# EAGLE schematic Optronik (EAGLE 7.5.0)

## Sheet 1 of 4: MCU_MAIN
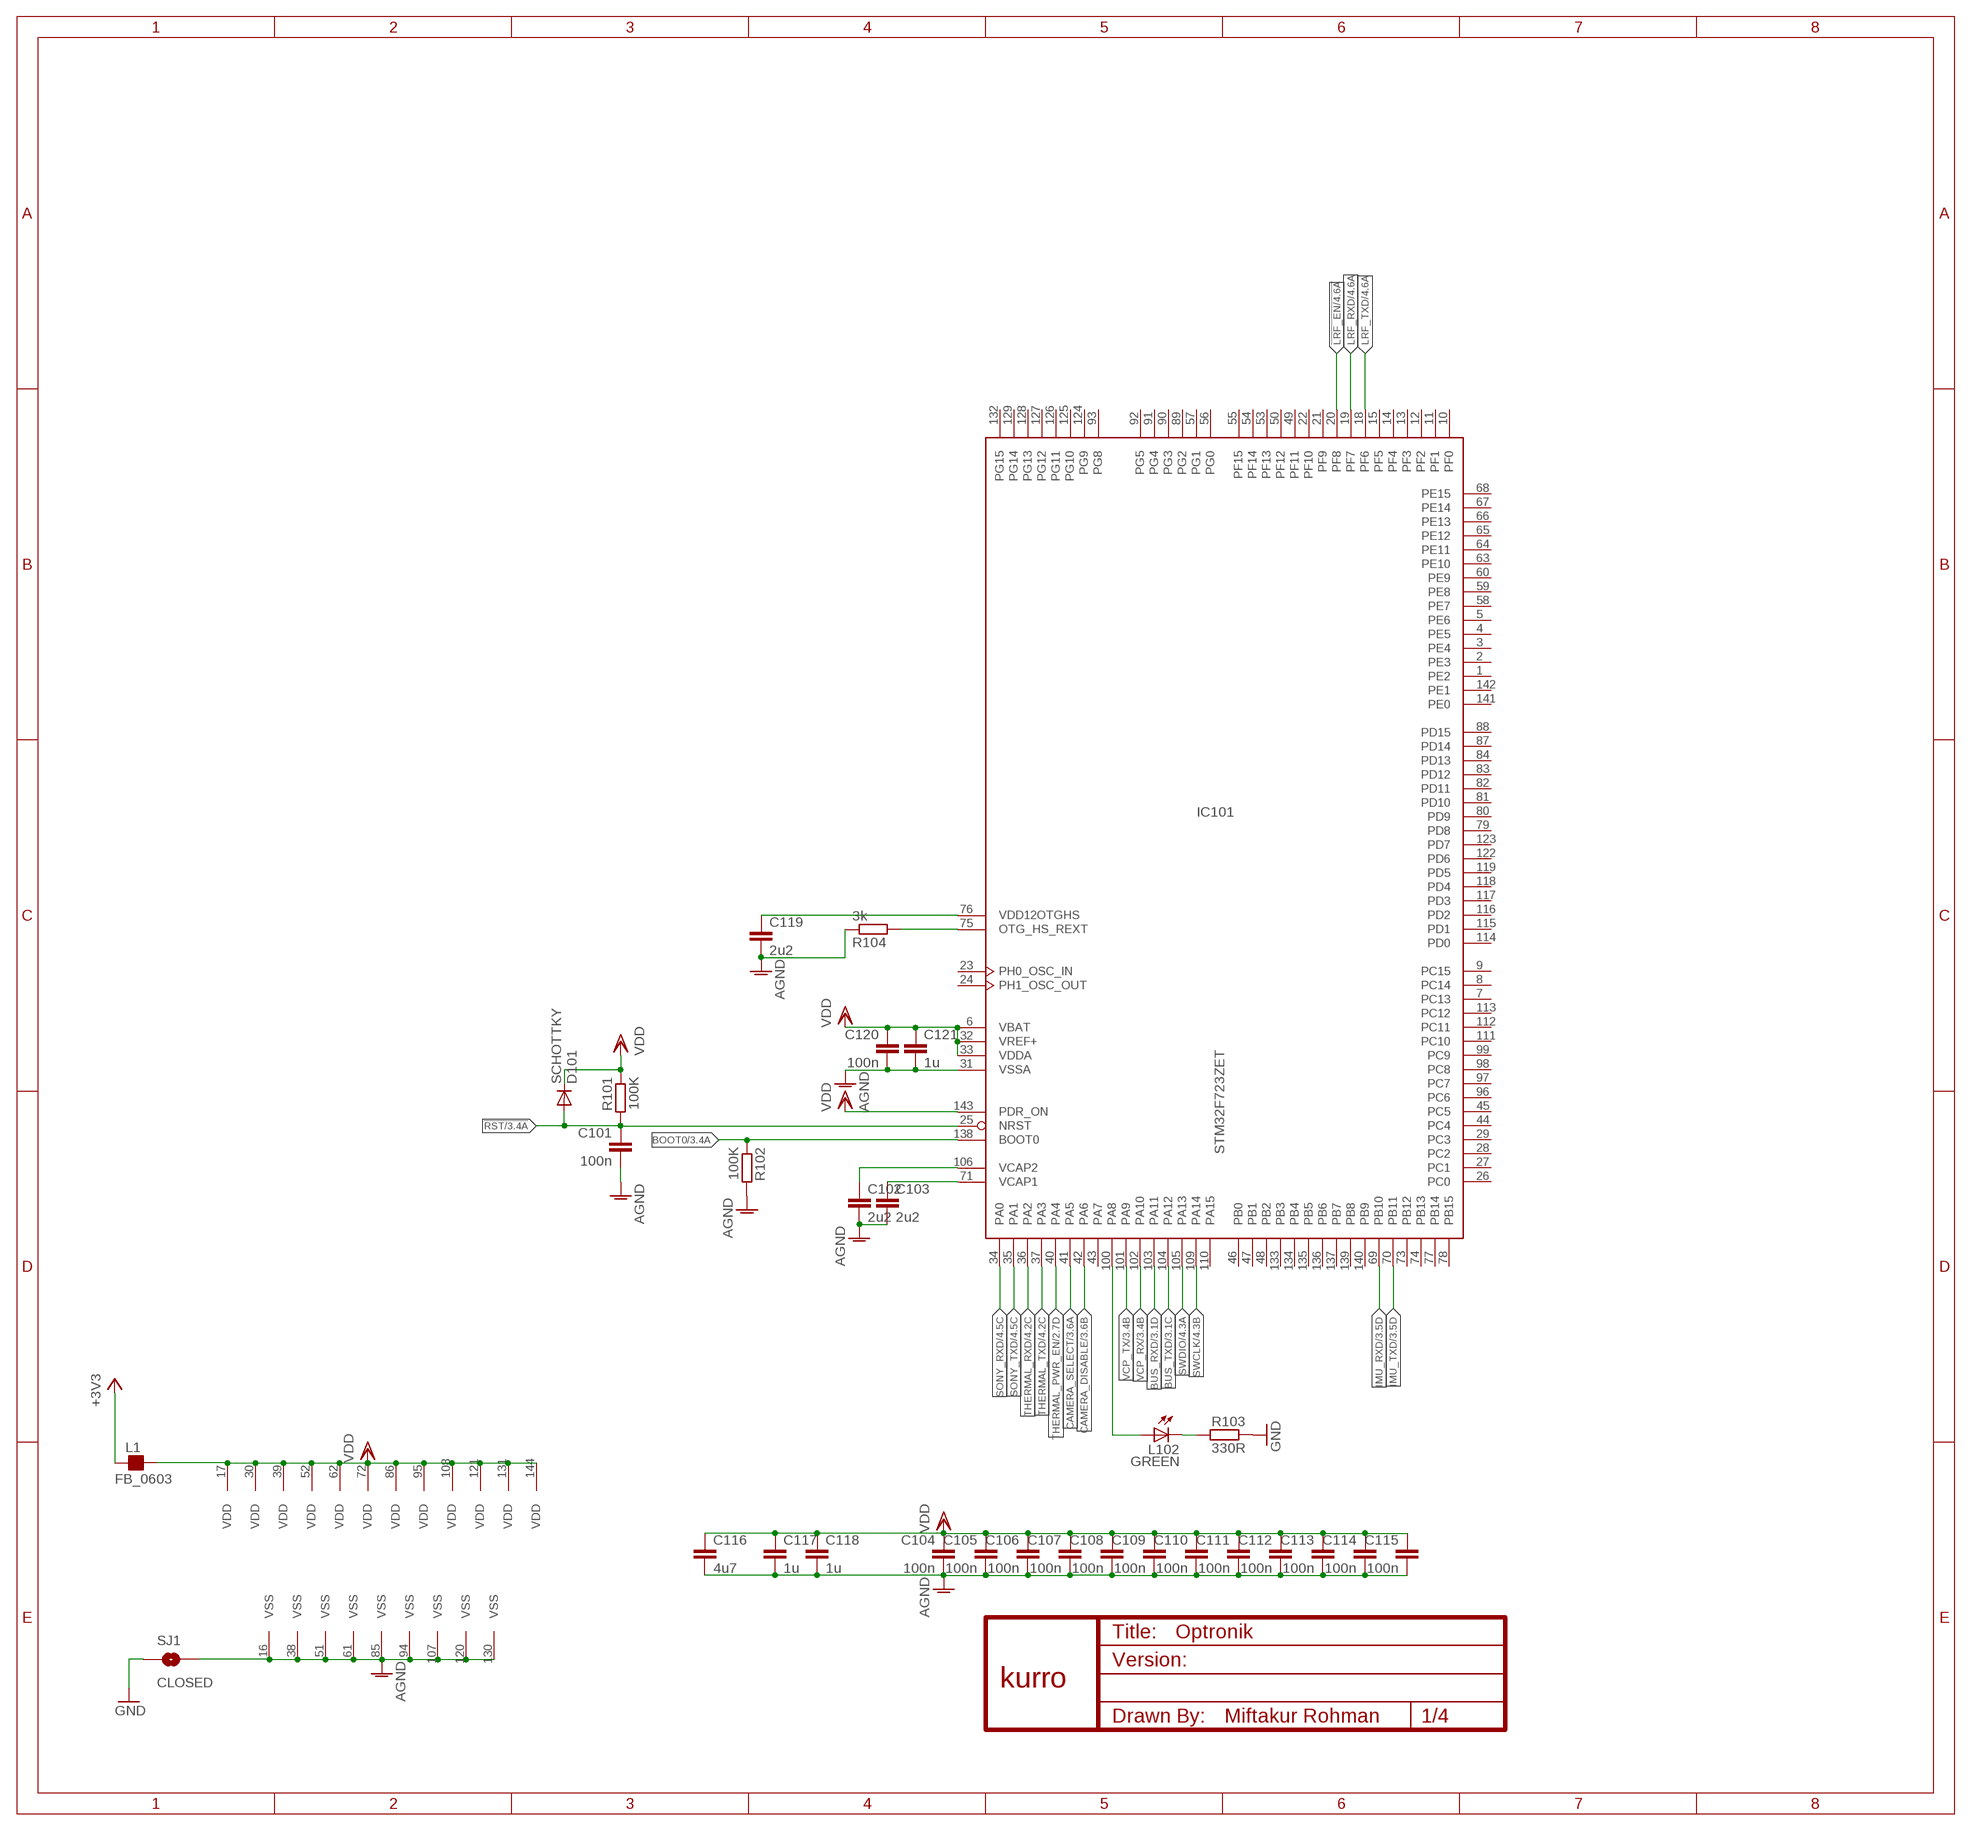
[diagram p0: schematic, sheet 1]

### Parts
C101  100n  C-EUC0603  [C0603]
C102  2u2  C-EUC0805  [C0805]
C103  2u2  C-EUC0805  [C0805]
C104  100n  C-EUC0603  [C0603]
C105  100n  C-EUC0603  [C0603]
C106  100n  C-EUC0603  [C0603]
C107  100n  C-EUC0603  [C0603]
C108  100n  C-EUC0603  [C0603]
C109  100n  C-EUC0603  [C0603]
C110  100n  C-EUC0603  [C0603]
C111  100n  C-EUC0603  [C0603]
C112  100n  C-EUC0603  [C0603]
C113  100n  C-EUC0603  [C0603]
C114  100n  C-EUC0603  [C0603]
C115  100n  C-EUC0603  [C0603]
C116  4u7  C-EUC0805  [C0805]
C117  1u  C-EUC0805  [C0805]
C118  1u  C-EUC0805  [C0805]
C119  2u2  C-EUC0805  [C0805]
C120  100n  C-EUC0603  [C0603]
C121  1u  C-EUC0805  [C0805]
D101  SCHOTTKY  DIODE-MICROMELF-W  [MICROMELF-W]
IC101  STM32F723ZET  [LQFP144-2]
L1  FB_0603  [L0603]
L102  GREEN  LEDCHIP-LED0805  [CHIP-LED0805]
R101  100K  R-EU_R0603  [R0603]
R102  100K  R-EU_R0603  [R0603]
R103  330R  R-EU_R0603  [R0603]
R104  3k  R-EU_R0603  [R0603]
SJ1  CLOSED  SOLDERJUMPERTRACE_THICK  [SJ_2S-TRACE_THICK]
U$2  KURRO_FOOTPRINT  [KURRO-LOGO]

### Nets
!LRF_EN [ic]: IC101.20(PF8) ; also sheet 4
!RST [ic]: C101.1 D101.A IC101.25(NRST) R101.2 ; also sheet 3
+3V3: L1.1 ; also sheet 2,3
AGND [ic]: C101.2 C102.2 C103.2 C104.2 C105.2 C106.2 C107.2 C108.2 C109.2 C110.2 C111.2 C112.2 C113.2 C114.2 C115.2 C116.2 C117.2 C118.2 C119.2 C120.2 C121.2 IC101.16(VSS) IC101.31(VSSA) IC101.38(VSS) IC101.51(VSS) IC101.61(VSS) IC101.85(VSS) IC101.94(VSS) IC101.107(VSS) IC101.120(VSS) IC101.130(VSS) R102.2 R104.1 SJ1.2
BOOT0 [ic]: IC101.138(BOOT0) R102.1 ; also sheet 3
BUS_RXD: IC101.103(PA11) ; also sheet 3
BUS_TXD: IC101.104(PA12) ; also sheet 3
CAMERA_DISABLE: IC101.42(PA6) ; also sheet 3
CAMERA_SELECT [ic]: IC101.41(PA5) ; also sheet 3
GND: R103.1 SJ1.1 ; also sheet 2,3,4
IMU_RXD [ic]: IC101.69(PB10) ; also sheet 3
IMU_TXD [ic]: IC101.70(PB11) ; also sheet 3
LRF_RXD [ic]: IC101.19(PF7) ; also sheet 4
LRF_TXD [ic]: IC101.18(PF6) ; also sheet 4
N$1: IC101.75(OTG_HS_REXT) R104.2
N$2: IC101.100(PA8) L102.A
N$9: L102.C R103.2
N$13: C119.1 IC101.76(VDD12OTGHS)
N$30: C103.1 IC101.71(VCAP1)
N$46: C102.1 IC101.106(VCAP2)
SONY_RXD [ic]: IC101.34(PA0) ; also sheet 4
SONY_TXD [ic]: IC101.35(PA1) ; also sheet 4
SWCLK [ic]: IC101.109(PA14) ; also sheet 4
SWDIO [ic]: IC101.105(PA13) ; also sheet 4
THERMAL_PWR_EN [ic]: IC101.40(PA4) ; also sheet 2
THERMAL_RXD [ic]: IC101.36(PA2) ; also sheet 4
THERMAL_TXD [ic]: IC101.37(PA3) ; also sheet 4
VCP_RX [ic]: IC101.102(PA10) ; also sheet 3,4
VCP_TX [ic]: IC101.101(PA9) ; also sheet 3,4
VDD [ic]: C104.1 C105.1 C106.1 C107.1 C108.1 C109.1 C110.1 C111.1 C112.1 C113.1 C114.1 C115.1 C116.1 C117.1 C118.1 C120.1 C121.1 D101.C IC101.6(VBAT) IC101.17(VDD) IC101.30(VDD) IC101.32(VREF+) IC101.33(VDDA) IC101.39(VDD) IC101.52(VDD) IC101.62(VDD) IC101.72(VDD) IC101.86(VDD) IC101.95(VDD) IC101.108(VDD) IC101.121(VDD) IC101.131(VDD) IC101.143(PDR_ON) IC101.144(VDD) L1.2 R101.1 ; also sheet 4
Unconnected: IC101.1(PE2) IC101.2(PE3) IC101.3(PE4) IC101.4(PE5) IC101.5(PE6) IC101.7(PC13) IC101.8(PC14) IC101.9(PC15) IC101.10(PF0) IC101.11(PF1) IC101.12(PF2) IC101.13(PF3) IC101.14(PF4) IC101.15(PF5) IC101.21(PF9) IC101.22(PF10) IC101.23(PH0_OSC_IN) IC101.24(PH1_OSC_OUT) IC101.26(PC0) IC101.27(PC1) IC101.28(PC2) IC101.29(PC3) IC101.43(PA7) IC101.44(PC4) IC101.45(PC5) IC101.46(PB0) IC101.47(PB1) IC101.48(PB2) IC101.49(PF11) IC101.50(PF12) IC101.53(PF13) IC101.54(PF14) IC101.55(PF15) IC101.56(PG0) IC101.57(PG1) IC101.58(PE7) IC101.59(PE8) IC101.60(PE9) IC101.63(PE10) IC101.64(PE11) IC101.65(PE12) IC101.66(PE13) IC101.67(PE14) IC101.68(PE15) IC101.73(PB12) IC101.74(PB13) IC101.77(PB14) IC101.78(PB15) IC101.79(PD8) IC101.80(PD9) IC101.81(PD10) IC101.82(PD11) IC101.83(PD12) IC101.84(PD13) IC101.87(PD14) IC101.88(PD15) IC101.89(PG2) IC101.90(PG3) IC101.91(PG4) IC101.92(PG5) IC101.93(PG8) IC101.96(PC6) IC101.97(PC7) IC101.98(PC8) IC101.99(PC9) IC101.110(PA15) IC101.111(PC10) IC101.112(PC11) IC101.113(PC12) IC101.114(PD0) IC101.115(PD1) IC101.116(PD2) IC101.117(PD3) IC101.118(PD4) IC101.119(PD5) IC101.122(PD6) IC101.123(PD7) IC101.124(PG9) IC101.125(PG10) IC101.126(PG11) IC101.127(PG12) IC101.128(PG13) IC101.129(PG14) IC101.132(PG15) IC101.133(PB3) IC101.134(PB4) IC101.135(PB5) IC101.136(PB6) IC101.137(PB7) IC101.139(PB8) IC101.140(PB9) IC101.141(PE0) IC101.142(PE1)

## Sheet 2 of 4: PSU
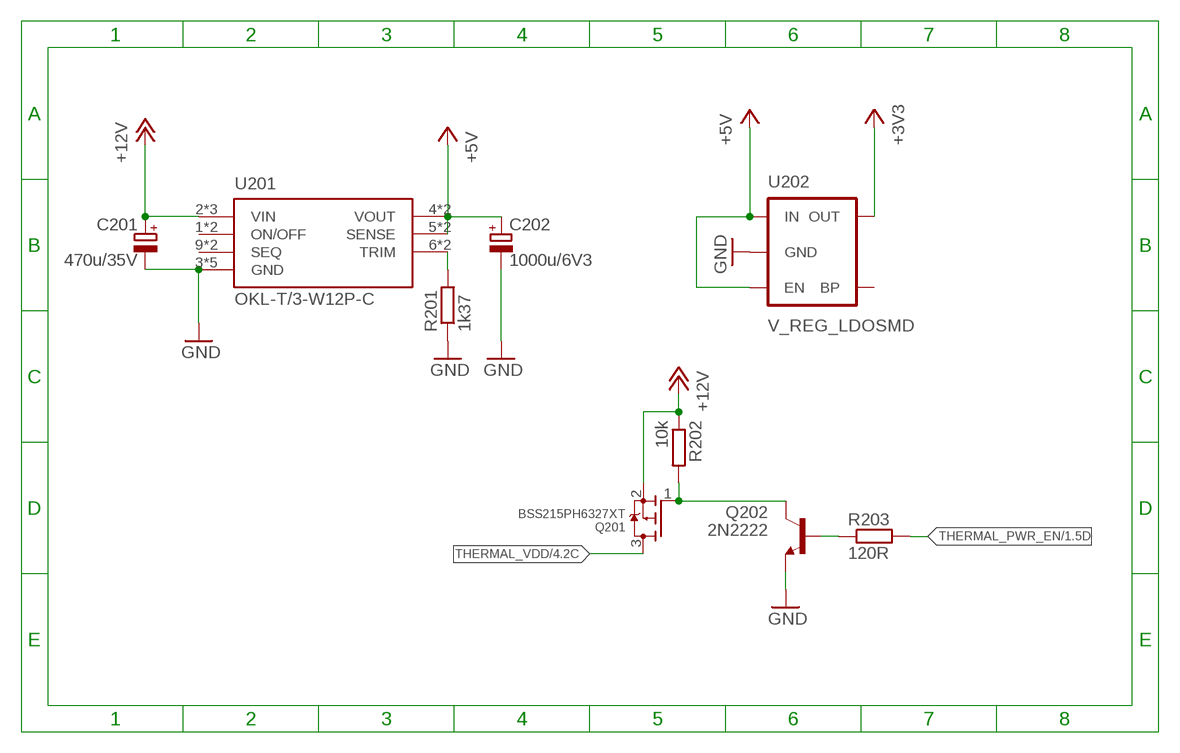
[diagram p1: schematic, sheet 2]

### Parts
C201  470u/35V  CPOL-EU153CLV-1012  [153CLV-1012]
C202  1000u/6V3  CPOL-EU153CLV-0810  [153CLV-0810]
Q201  BSS215PH6327XT  A03401-WIDE  [SOT23-W]
Q202  2N2222  2N2222-REFLOW  [SOT23]
R201  1k37  R-EU_R0603  [R0603]
R202  10k  R-EU_R0603  [R0603]
R203  120R  R-EU_R0603  [R0603]
U201  OKL-T/3-W12P-C  OKL2T/3W5NC_SMD  [OKL2T/3W5NC]
U202  V_REG_LDOSMD  [SOT23-5]

### Nets
+3V3: U202.5(OUT) ; also sheet 1,3
+5V: C202.+ U201.4(VOUT) U201.4@1(VOUT) U201.5(SENSE) U201.5@1(SENSE) U202.1(IN) U202.3(EN) ; also sheet 3,4
+12V: C201.+ Q201.2(S) R202.1 U201.2(VIN) U201.2@1(VIN) U201.2@2(VIN) ; also sheet 4
GND: C201.- C202.- Q202.2(E) R201.1 U201.3(GND) U201.3@1(GND) U201.3@2(GND) U201.7(GND) U201.7@1(GND) U202.2(GND) ; also sheet 1,3,4
N$6: R201.2 U201.6(TRIM) U201.6@1(TRIM)
N$17: Q202.1(B) R203.1
N$39: Q201.1(G) Q202.3(C) R202.2
THERMAL_PWR_EN [ic]: R203.2 ; also sheet 1
THERMAL_VDD: Q201.3(D) ; also sheet 4
Unconnected: U201.1(ON/OFF) U201.1@1(ON/OFF) U201.9(SEQ) U201.9@1(SEQ) U202.4(BP)

## Sheet 3 of 4
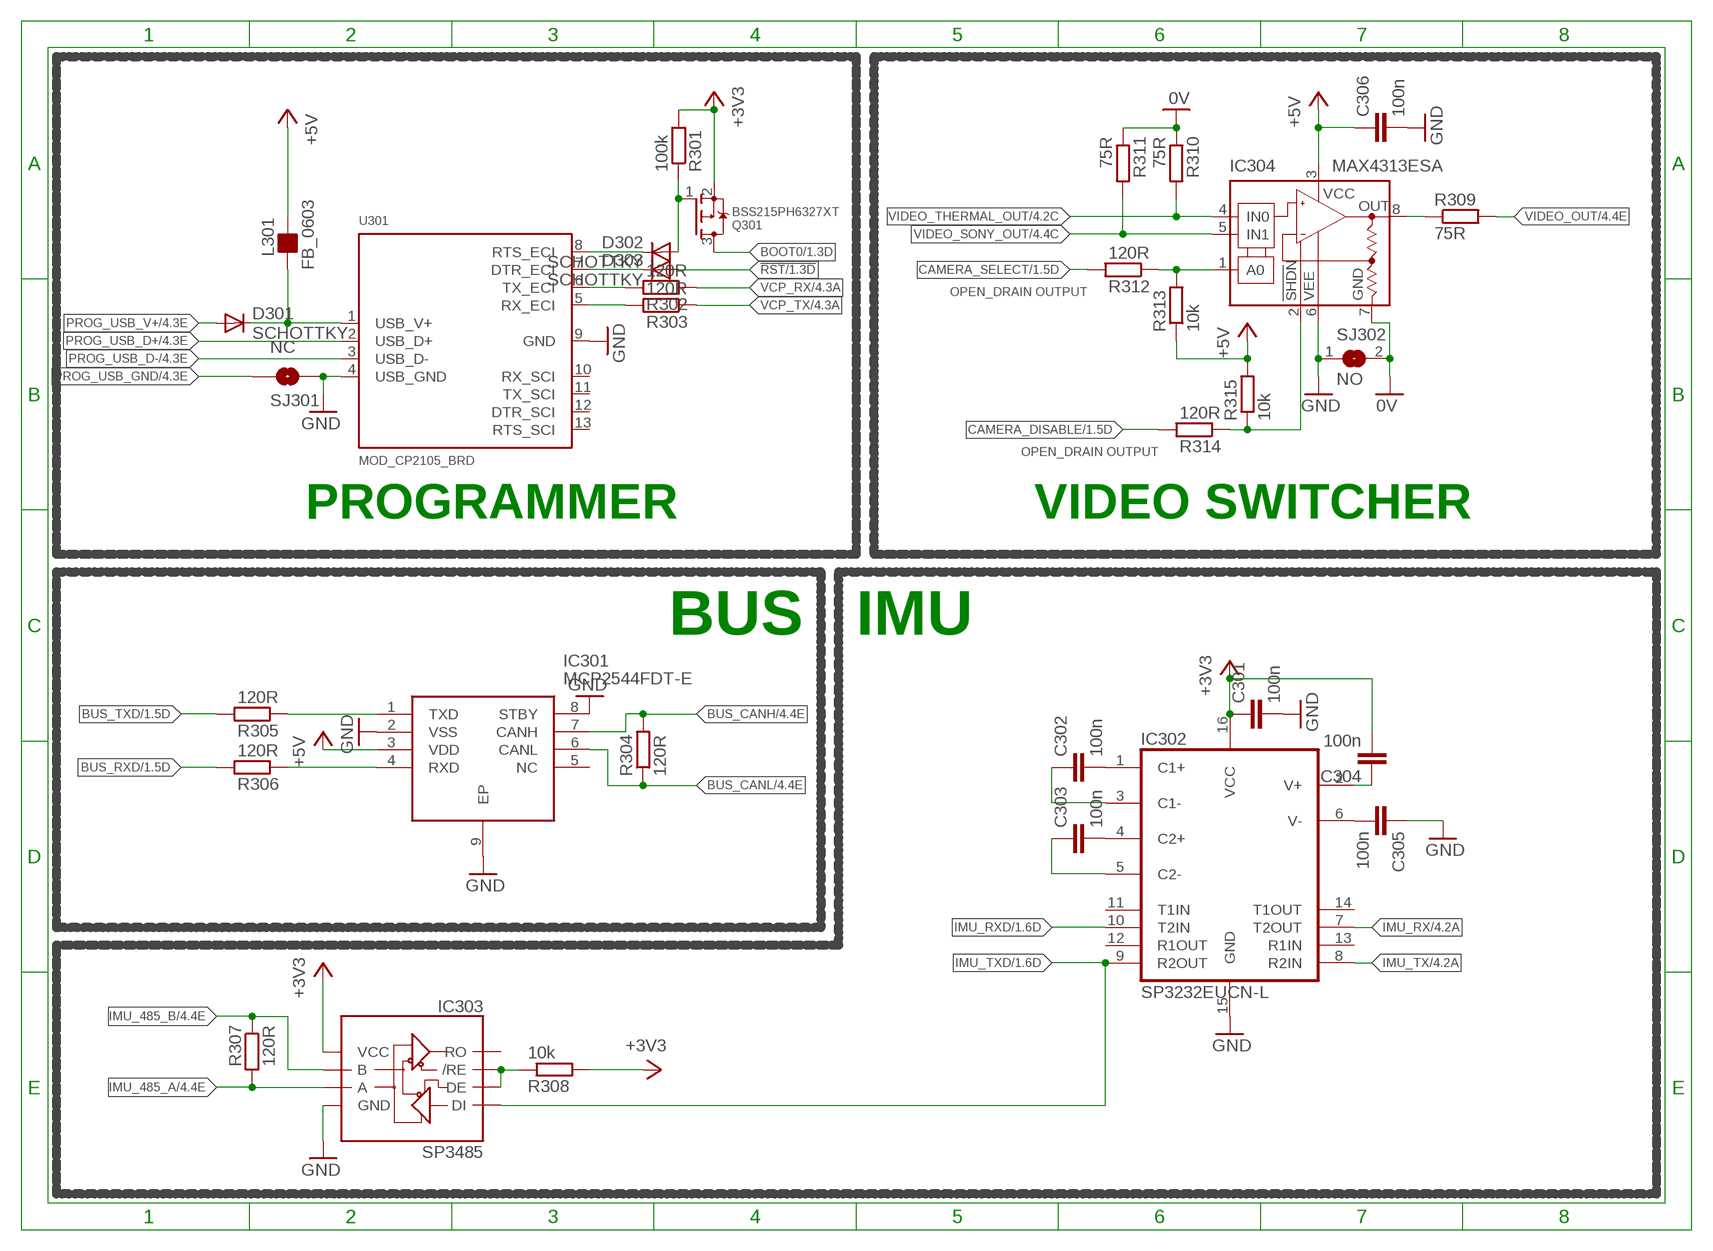
[diagram p2: schematic, sheet 3]

### Parts
C301  100n  C-EUC0603  [C0603]
C302  100n  C-EUC0603  [C0603]
C303  100n  C-EUC0603  [C0603]
C304  100n  C-EUC0603  [C0603]
C305  100n  C-EUC0603  [C0603]
C306  100n  C-EUC0603  [C0603]
D301  SCHOTTKY  DIODE-MICROMELF-W  [MICROMELF-W]
D302  SCHOTTKY  DIODE-MICROMELF-W  [MICROMELF-W]
D303  SCHOTTKY  DIODE-MICROMELF-W  [MICROMELF-W]
IC301  MCP2544FDT-E  [TDFN-8]
IC302  SP3232EUCN-L  MAX232SOIC16  [SO016]
IC303  SP3485  RS485SOIC  [SO08]
IC304  MAX4313ESA  [SO08]
L301  FB_0603  [L0603]
Q301  BSS215PH6327XT  A03401-WIDE  [SOT23-W]
R301  100k  R-EU_R0603  [R0603]
R302  120R  R-EU_R0603  [R0603]
R303  120R  R-EU_R0603  [R0603]
R304  120R  R-EU_R0603  [R0603]
R305  120R  R-EU_R0603  [R0603]
R306  120R  R-EU_R0603  [R0603]
R307  120R  R-EU_R0603  [R0603]
R308  10k  R-EU_R0603  [R0603]
R309  75R  R-EU_R0603  [R0603]
R310  75R  R-EU_R0603  [R0603]
R311  75R  R-EU_R0603  [R0603]
R312  120R  R-EU_R0603  [R0603]
R313  10k  R-EU_R0603  [R0603]
R314  120R  R-EU_R0603  [R0603]
R315  10k  R-EU_R0603  [R0603]
SJ301  NC  SOLDERJUMPERTRACE_THICK  [SJ_2S-TRACE_THICK]
SJ302  NO  SJS  [SJS]
U301  MOD_CP2105_BRD  [MOD_CP2105_BOARD]

### Nets
0V: IC304.7(GND) R310.1 R311.1 SJ302.2 ; also sheet 4
!RST [ic]: D303.A ; also sheet 1
+3V3: C301.1 C304.2 IC302.16(VCC) IC303.8(VCC) Q301.2(S) R301.2 R308.2 ; also sheet 1,2
+5V: C306.1 IC301.3(VDD) IC304.3(V+) L301.2 R313.1 R315.2 ; also sheet 2,4
BOOT0 [ic]: Q301.3(D) ; also sheet 1
BUS_CANH: IC301.7(CANH) R304.2 ; also sheet 4
BUS_CANL: IC301.6(CANL) R304.1 ; also sheet 4
BUS_RXD: R306.2 ; also sheet 1
BUS_TXD: R305.2 ; also sheet 1
CAMERA_DISABLE: R314.2 ; also sheet 1
CAMERA_SELECT [ic]: R312.2 ; also sheet 1
GND: C301.2 C305.1 C306.2 IC301.2(VSS) IC301.8(STBY) IC301.9(EP) IC302.15(GND) IC303.5(GND) IC304.6(V-) SJ301.2 SJ302.1 U301.4(USB_GND) U301.9(GND) ; also sheet 1,2,4
IMU_485_A: IC303.6(A) R307.2 ; also sheet 4
IMU_485_B: IC303.7(B) R307.1 ; also sheet 4
IMU_RX: IC302.7(T2OUT) ; also sheet 4
IMU_RXD [ic]: IC302.10(T2IN) ; also sheet 1
IMU_TX: IC302.8(R2IN) ; also sheet 4
IMU_TXD [ic]: IC302.9(R2OUT) IC303.4(DI) ; also sheet 1
N$10: IC303.2(/RE) IC303.3(DE) R308.1
N$12: IC304.1(A0) R312.1 R313.2
N$14: IC301.1(TXD) R305.1
N$15: IC301.4(RXD) R306.1
N$16: R303.2 U301.5(RX_ECI)
N$18: R302.2 U301.6(TX_ECI)
N$19: D303.C U301.7(DTR_ECI)
N$20: IC304.8(OUT) R309.1
N$21: D302.C U301.8(RTS_ECI)
N$22: IC304.2(!SHDN) R314.1 R315.1
N$23: D301.C L301.1 U301.1(USB_V+)
N$24: D302.A Q301.1(G) R301.1
N$31: C305.2 IC302.6(V-)
N$32: C302.2 IC302.1(C1+)
N$33: C303.2 IC302.4(C2+)
N$68: C302.1 IC302.3(C1-)
N$69: C303.1 IC302.5(C2-)
N$72: C304.1 IC302.2(V+)
PROG_USB_D+: U301.2(USB_D+) ; also sheet 4
PROG_USB_D-: U301.3(USB_D-) ; also sheet 4
PROG_USB_GND: SJ301.1 ; also sheet 4
PROG_USB_V+: D301.A ; also sheet 4
VCP_RX [ic]: R302.1 ; also sheet 1,4
VCP_TX [ic]: R303.1 ; also sheet 1,4
VIDEO_OUT: R309.2 ; also sheet 4
VIDEO_SONY_OUT [ic]: IC304.5(IN1) R311.2 ; also sheet 4
VIDEO_THERMAL_OUT: IC304.4(IN0) R310.2 ; also sheet 4
Unconnected: IC301.5(NC) IC302.11(T1IN) IC302.12(R1OUT) IC302.13(R1IN) IC302.14(T1OUT) IC303.1(RO) U301.10(RX_SCI) U301.11(TX_SCI) U301.12(DTR_SCI) U301.13(RTS_SCI)

### Notes on the sheet
- OPEN_DRAIN OUTPUT
- OPEN_DRAIN OUTPUT
- PROGRAMMER | VIDEO SWITCHER
- BUS | IMU

## Sheet 4 of 4: CONNECTOR
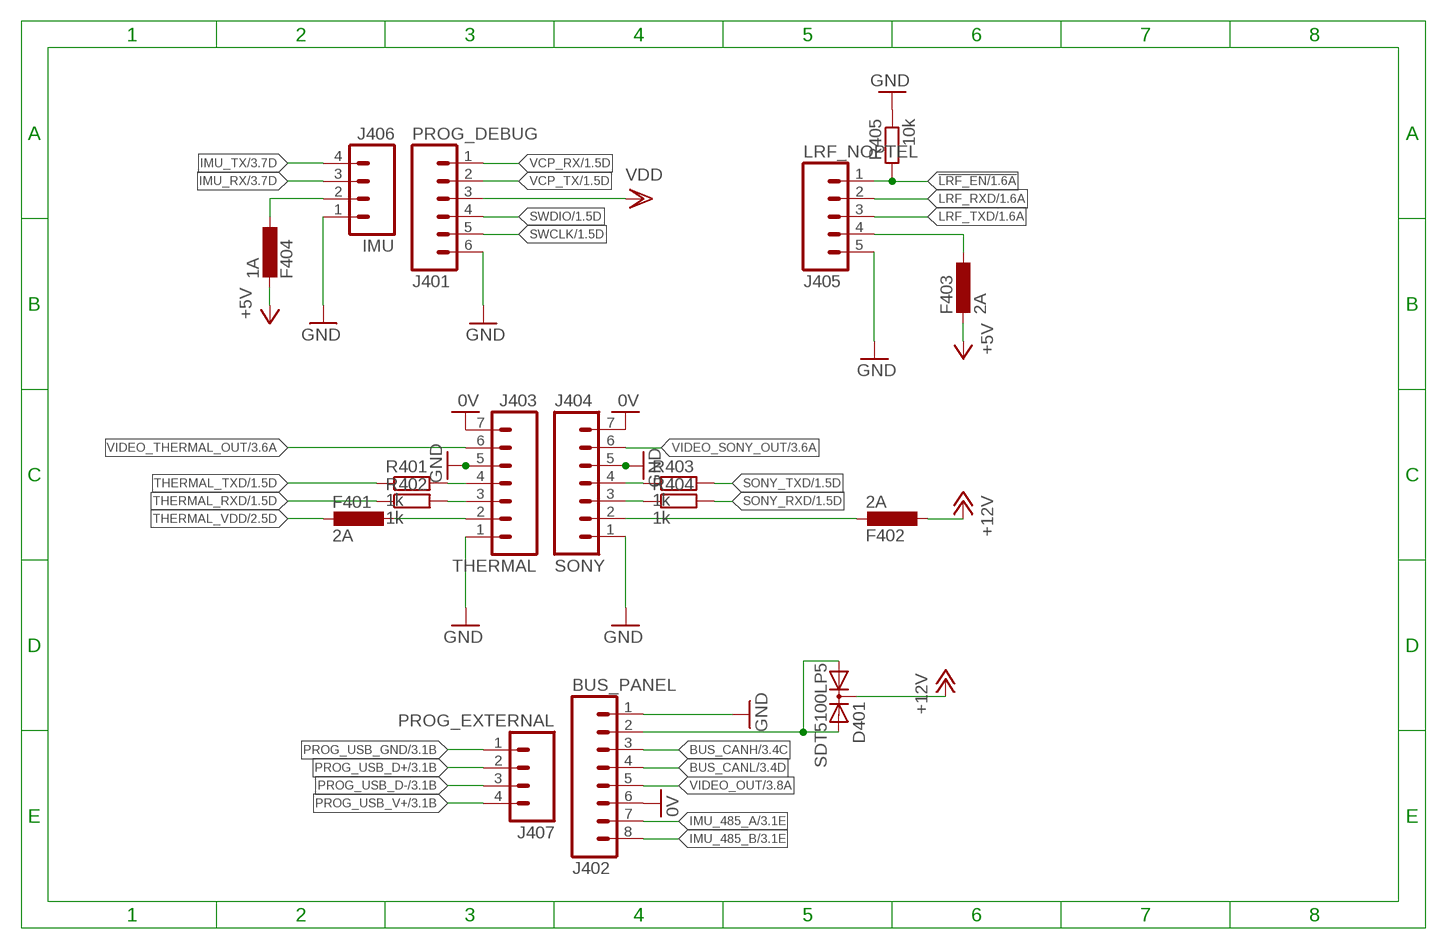
[diagram p3: schematic, sheet 4]

### Parts
D401  SDT5100LP5  [POWERDI5-3]
F401  2A  L-EUL0805  [L0805]
F402  2A  L-EUL0805  [L0805]
F403  2A  L-EUL0805  [L0805]
F404  1A  L-EUL0805  [L0805]
J401  PROG_DEBUG  M06-XHS-VERT-SMD  [XHS-6-VERT-SMD]
J402  BUS_PANEL  M08-XHS-RA  [XHS-8-RA]
J403  THERMAL  M07-XHS-RA  [XHS-7-RA]
J404  SONY  M07-XHS-RA  [XHS-7-RA]
J405  LRF_NOPTEL  M05-XHS-RA  [XHS-5-RA]
J406  IMU  M04-XHS-RA  [XHS-4-RA]
J407  PROG_EXTERNAL  M04-XHS-RA  [XHS-4-RA]
R401  1k  R-EU_R0603  [R0603]
R402  1k  R-EU_R0603  [R0603]
R403  1k  R-EU_R0603  [R0603]
R404  1k  R-EU_R0603  [R0603]
R405  10k  R-EU_R0603  [R0603]

### Nets
0V: J402.6 J403.7 J404.7 ; also sheet 3
!LRF_EN [ic]: J405.1 R405.2 ; also sheet 1
+5V: F403.2 F404.2 ; also sheet 2,3
+12V: D401.3 F402.1 ; also sheet 2
BUS_CANH: J402.3 ; also sheet 3
BUS_CANL: J402.4 ; also sheet 3
GND: J401.6 J402.1 J403.1 J403.5 J404.1 J404.5 J405.5 J406.1 R405.1 ; also sheet 1,2,3
IMU_485_A: J402.7 ; also sheet 3
IMU_485_B: J402.8 ; also sheet 3
IMU_RX: J406.3 ; also sheet 3
IMU_TX: J406.4 ; also sheet 3
LRF_RXD [ic]: J405.2 ; also sheet 1
LRF_TXD [ic]: J405.3 ; also sheet 1
N$3: F403.1 J405.4
N$4 [ic]: F402.2 J404.2
N$5: J403.4 R401.2
N$7: F401.1 J403.2
N$8: J403.3 R402.2
N$27 [ic]: J404.4 R403.1
N$29 [ic]: J404.3 R404.1
N$55: F404.1 J406.2
PROG_USB_D+: J407.2 ; also sheet 3
PROG_USB_D-: J407.3 ; also sheet 3
PROG_USB_GND: J407.1 ; also sheet 3
PROG_USB_V+: J407.4 ; also sheet 3
RAW_12V: D401.1 D401.2 J402.2
SONY_RXD [ic]: R404.2 ; also sheet 1
SONY_TXD [ic]: R403.2 ; also sheet 1
SWCLK [ic]: J401.5 ; also sheet 1
SWDIO [ic]: J401.4 ; also sheet 1
THERMAL_RXD [ic]: R402.1 ; also sheet 1
THERMAL_TXD [ic]: R401.1 ; also sheet 1
THERMAL_VDD: F401.2 ; also sheet 2
VCP_RX [ic]: J401.1 ; also sheet 1,3
VCP_TX [ic]: J401.2 ; also sheet 1,3
VDD [ic]: J401.3 ; also sheet 1
VIDEO_OUT: J402.5 ; also sheet 3
VIDEO_SONY_OUT [ic]: J404.6 ; also sheet 3
VIDEO_THERMAL_OUT: J403.6 ; also sheet 3

## Library data of the parts
C101 C104-C115 C120 C301-C306 = resistor:C-EU: CAPACITOR, European symbol
C102 C103 C116-C119 C121 = rcl:C-EU: CAPACITOR, European symbol
C201 C202 = resistor:CPOL-EU: POLARIZED CAPACITOR, European symbol
D101 D301-D303 = diode:DIODE-: DIODE
D401 = rcws:SDT5100LP5
F401-F404 = rcl:L-EU: INDUCTOR, European symbol
IC101 = micro-stm_v3.1:STM32F723Z*T: ARM 32-bit Cortex™-M7 CPU 216 MHz maximum frequency 256 to 512 Kbytes of Flash memory 256 kbytes of SRAM 122 GPIOs 1.7 to 3.6 V application supply
IC301 = rcws:MCP2544FDT-E
IC302 = SparkFun-DigitalIC:MAX232: RS232 Transceiver Very common IC. This is generically called 'MAX232', but works with the 3V equivalent MAX3232 generic ICs. Field tested and mother approved. Spark Fun Electronics SKU : COM-00316 (DIP) and COM-00589 (SMD); PROD_ID: IC-08171
IC303 = SparkFun-DigitalIC:RS485: RS485 transceiver
IC304 = maxim:MAX4313: Video Multiplexer-Amplifier High-Speed, Low-Power, Single-Supply, Multichannel
J401 = SparkFun-Connectors:M06: Header 6 Standard 6-pin 0.1" header. Use with straight break away headers (SKU : PRT-00116), right angle break away headers (PRT-00553), swiss pins (PRT-00743), machine pins (PRT-00117), and female headers (PRT-00115). Molex polarized connector foot print use with SKU : PRT-08094 with associated crimp pins and housings. NOTES ON THE VARIANTS LOCK and LOCK_LONGPADS... This footprint was designed to help hold the alignment of a through-hole component (i.e. 6-pin header) while soldering it into place. You may notice that each hole has been shifted either up or down by 0.005 of an inch from it's more standard position (which is a perfectly straight line). This slight alteration caused the pins (the squares in the middle) to touch the edges of the holes. Because they are alternating, it causes a "brace" to hold the component in place. 0.005 has proven to be the perfect amount of "off-center" position when using our standard breakaway headers. Although looks a little odd when you look at the bare footprint, once you have a header in there, the alteration is very hard to notice. Also,if you push a header all the way into place, it is covered up entirely on the bottom side. This idea of altering the position of holes to aid alignment will be further integrated into the Sparkfun Library for other footprints. It can help hold any component with 3 or more connection pins.
J402 = SparkFun-Connectors:M08: Header 8 Standard 8-pin 0.1" header. Use with straight break away headers (SKU : PRT-00116), right angle break away headers (PRT-00553), swiss pins (PRT-00743), machine pins (PRT-00117), and female headers (PRT-00115).
J403 J404 = SparkFun-Connectors:M07: Header 7 Standard 7-pin 0.1" header. Use with straight break away headers (SKU : PRT-00116), right angle break away headers (PRT-00553), swiss pins (PRT-00743), machine pins (PRT-00117), and female headers (PRT-00115). NOTES ON THE VARIANTS LOCK and LOCK_LONGPADS... This footprint was designed to help hold the alignment of a through-hole component (i.e. 7-pin header) while soldering it into place. You may notice that each hole has been shifted either up or down by 0.005 of an inch from it's more standard position (which is usually a perfectly straight line). This slight alteration caused the pins (the squares in the middle) to touch the edges of the holes. Because they are alternating, it causes a "brace" to hold the header in place. 0.005 has proven to be the perfect amount of "off-center" position when using our standard breakaway headers. Although looks a little odd when you look at the bare footprint, once you have a header in there, the alteration is very hard to notice. Also, if you push a header all the way into place, it is covered up entirely on the bottom side. This idea of altering the position of holes to aid alignment will be further integrated into the Sparkfun Library for other footprints. It can help hold any component with 3 or more connection pins.
J405 = SparkFun-Connectors:M05: Header 5 Standard 5-pin 0.1" header. Use with straight break away headers (SKU : PRT-00116), right angle break away headers (PRT-00553), swiss pins (PRT-00743), machine pins (PRT-00117), and female headers (PRT-00115). Molex polarized connector foot print use with SKU : PRT-08230 with associated crimp pins and housings.
J406 J407 = SparkFun-Connectors:M04: Header 4 Standard 4-pin 0.1" header. Use with straight break away headers (SKU : PRT-00116), right angle break away headers (PRT-00553), swiss pins (PRT-00743), machine pins (PRT-00117), and female headers (PRT-00115). Molex polarized connector foot print use with SKU : PRT-08231 with associated crimp pins and housings. 1MM SMD Version SKU: PRT-10208
L1 L301 = rc-master:FB_: FERRITE BEAD
L102 = led:LED: LED OSRAM: - CHIPLED LG R971, LG N971, LY N971, LG Q971, LY Q971, LO R971, LY R971 LH N974, LH R974 LS Q976, LO Q976, LY Q976 LO Q996 - Hyper CHIPLED LW Q18S LB Q993, LB Q99A, LB R99A - SideLED LS A670, LO A670, LY A670, LG A670, LP A670 LB A673, LV A673, LT A673, LW A673 LH A674 LY A675 LS A676, LA A676, LO A676, LY A676, LW A676 LS A679, LY A679, LG A679 - Hyper Micro SIDELED® LS Y876, LA Y876, LO Y876, LY Y876 LT Y87S - SmartLED LW L88C, LW L88S LB L89C, LB L89S, LG L890 LS L89K, LO L89K, LY L89K LS L896, LA L896, LO L896, LY L896 - TOPLED LS T670, LO T670, LY T670, LG T670, LP T670 LSG T670, LSP T670, LSY T670, LOP T670, LYG T670 LG T671, LOG T671, LSG T671 LB T673, LV T673, LT T673, LW T673 LH T674 LS T676, LA T676, LO T676, LY T676, LB T676, LH T676, LSB T676, LW T676 LB T67C, LV T67C, LT T67C, LS T67K, LO T67K, LY T67K, LW E67C LS E67B, LA E67B, LO E67B, LY E67B, LB E67C, LV E67C, LT E67C LW T67C LS T679, LY T679, LG T679 LS T770, LO T770, LY T770, LG T770, LP T770 LB T773, LV T773, LT T773, LW T773 LH T774 LS E675, LA E675, LY E675, LS T675 LS T776, LA T776, LO T776, LY T776, LB T776 LHGB T686 LT T68C, LB T68C - Hyper Mini TOPLED® LB M676 - Mini TOPLED Santana® LG M470 LS M47K, LO M47K, LY M47K Source: http://www.osram.convergy.de LUXEON: - LUMILED® LXK2-PW12-R00, LXK2-PW12-S00, LXK2-PW14-U00, LXK2-PW14-V00 LXK2-PM12-R00, LXK2-PM12-S00, LXK2-PM14-U00 LXK2-PE12-Q00, LXK2-PE12-R00, LXK2-PE12-S00, LXK2-PE14-T00, LXK2-PE14-U00 LXK2-PB12-K00, LXK2-PB12-L00, LXK2-PB12-M00, LXK2-PB14-N00, LXK2-PB14-P00, LXK2-PB14-Q00 LXK2-PR12-L00, LXK2-PR12-M00, LXK2-PR14-Q00, LXK2-PR14-R00 LXK2-PD12-Q00, LXK2-PD12-R00, LXK2-PD12-S00 LXK2-PH12-R00, LXK2-PH12-S00 LXK2-PL12-P00, LXK2-PL12-Q00, LXK2-PL12-R00 Source: www.luxeon.com KINGBRIGHT: KA-3528ASYC Source: www.kingbright.com
Q201 = scorpion:A03401*: 30V P-Channel MOSFET Feature: VDS: -30V ID (at VGS=10V): -4A RDS(ON) (at VGS=10V): <50mOhm RDS(ON) (at VGS = 4.5V): <60mOhm RDS(ON) (at VGS = 2.5V): <85mOhm datasheet <http://www.aosmd.com/pdfs/datasheet/AO3401.pdf> tokopedia <https://www.tokopedia.com/tokopuwei/mosfet-ao3401-fet-ao3401-sot23-p-channel-30v-4a-a19t-sot-23-az37>
Q202 = scorpion:2N2222*
Q301 = rcws:A03401*: 30V P-Channel MOSFET Feature: VDS: -30V ID (at VGS=10V): -4A RDS(ON) (at VGS=10V): <50mOhm RDS(ON) (at VGS = 4.5V): <60mOhm RDS(ON) (at VGS = 2.5V): <85mOhm datasheet <http://www.aosmd.com/pdfs/datasheet/AO3401.pdf> tokopedia <https://www.tokopedia.com/tokopuwei/mosfet-ao3401-fet-ao3401-sot23-p-channel-30v-4a-a19t-sot-23-az37>
R101-R104 R202 R203 R301-R303 R307 R308 R401-R405 = resistor:R-EU_: RESISTOR, European symbol
R201 R304-R306 R309-R315 = rcl:R-EU_: RESISTOR, European symbol
SJ1 SJ301 = SparkFun:SOLDERJUMPER: Solder Jumper Standard SMD solder jumper. Used to automate production. Two varients : Normally Open and Normally Closed are the same, but have different paste layers. NC will have a large amount of paste and should jumper during reflow.
SJ302 = jumper:SJ: SMD solder JUMPER
U201 = encPhone:OKL2T/3W5NC
U202 = pixhawk2:V_REG_LDO: Voltage Regulator LDO Standard 150mA LDO voltage regulator in SOT-23 layout. Micrel part MIC5205. BP (by-pass) pin is used to lower output noise with 470pF cap.
U301 = rcws:MOD_CP2105
U$2 = SparkFun:KURRO_FOOTPRINT

## Net classes
0 default: width 0.203 mm, drill 0.29 mm, clearance 0.203 mm
1 ic: width 0.203 mm, drill 0.29 mm, clearance 0.203 mm
2 power: width 0.406 mm, drill 0.59 mm, clearance 0.406 mm